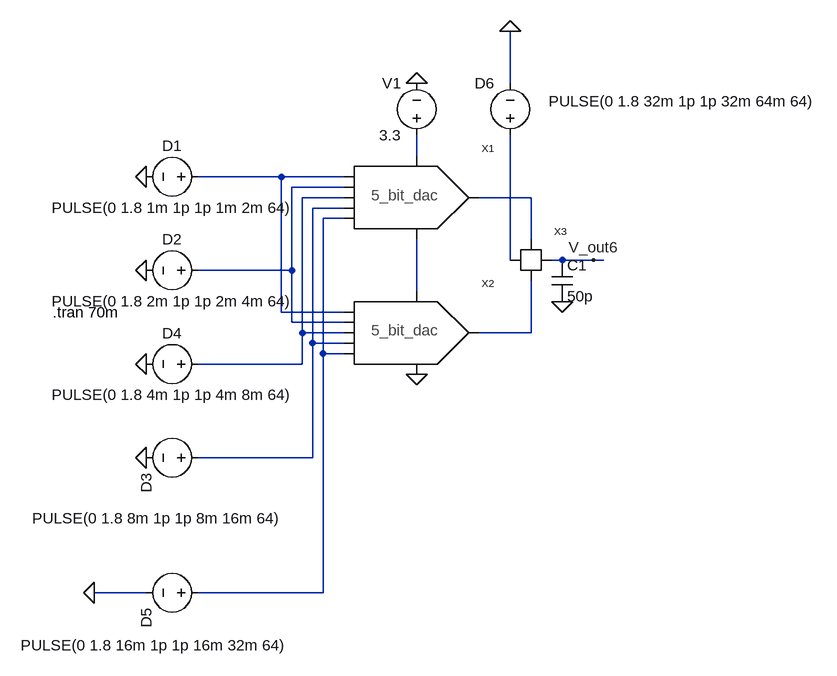
[diagram p0: schematic 6_bit_dac.asc]
6_bit_dac.asc, the LTspice schematic file:
Version 4
SHEET 1 880 836
WIRE 384 -48 384 -128
WIRE 240 64 240 32
WIRE 32 96 -96 96
WIRE 128 96 32 96
WIRE 128 112 48 112
WIRE 128 128 64 128
WIRE 416 128 336 128
WIRE 128 144 80 144
WIRE 128 160 96 160
WIRE 416 192 416 128
WIRE 384 224 384 32
WIRE 464 224 448 224
WIRE 512 224 464 224
WIRE 528 224 512 224
WIRE 48 240 48 112
WIRE 48 240 -96 240
WIRE 240 272 240 192
WIRE 32 304 32 96
WIRE 128 304 32 304
WIRE 48 320 48 240
WIRE 128 320 48 320
WIRE 64 336 64 128
WIRE 128 336 64 336
WIRE 416 336 416 256
WIRE 416 336 336 336
WIRE 80 352 80 144
WIRE 128 352 80 352
WIRE 96 368 96 160
WIRE 128 368 96 368
WIRE 64 384 64 336
WIRE 64 384 -96 384
WIRE 80 528 80 352
WIRE 80 528 -96 528
WIRE -176 736 -256 736
WIRE 96 736 96 368
WIRE 96 736 -96 736
FLAG -176 96 0
FLAG -176 240 0
FLAG -176 528 0
FLAG -176 384 0
FLAG -256 736 0
FLAG 240 -48 0
FLAG 240 400 0
FLAG 384 -128 0
FLAG 512 224 V_out6
FLAG 464 288 0
SYMBOL 5_bit_dac 192 128 R0
SYMATTR InstName X1
SYMBOL 5_bit_dac 192 336 R0
SYMATTR InstName X2
SYMBOL switch 416 224 R0
SYMATTR InstName X3
SYMBOL voltage -80 96 R90
WINDOW 0 -32 56 VBottom 2
WINDOW 3 32 56 VTop 2
WINDOW 123 0 0 Left 0
WINDOW 39 0 0 Left 0
SYMATTR InstName D1
SYMATTR Value PULSE(0 1.8 1m 1p 1p 1m 2m 64)
SYMBOL voltage -80 240 R90
WINDOW 0 -32 56 VBottom 2
WINDOW 3 32 56 VTop 2
WINDOW 123 0 0 Left 0
WINDOW 39 0 0 Left 0
SYMATTR InstName D2
SYMATTR Value PULSE(0 1.8 2m 1p 1p 2m 4m 64)
SYMBOL voltage -80 528 R90
WINDOW 0 24 96 Left 2
WINDOW 3 93 -113 VRight 2
WINDOW 123 0 0 Left 0
WINDOW 39 0 0 Left 0
SYMATTR InstName D3
SYMATTR Value PULSE(0 1.8 8m 1p 1p 8m 16m 64)
SYMBOL voltage -80 384 R90
WINDOW 0 -32 56 VBottom 2
WINDOW 3 32 56 VTop 2
WINDOW 123 0 0 Left 0
WINDOW 39 0 0 Left 0
SYMATTR InstName D4
SYMATTR Value PULSE(0 1.8 4m 1p 1p 4m 8m 64)
SYMBOL voltage -80 736 R90
WINDOW 0 24 96 Left 2
WINDOW 3 81 289 VLeft 2
WINDOW 123 0 0 Left 0
WINDOW 39 0 0 Left 0
SYMATTR InstName D5
SYMATTR Value PULSE(0 1.8 16m 1p 1p 16m 32m 64)
SYMBOL voltage 240 48 R180
WINDOW 0 24 96 Left 2
WINDOW 3 24 16 Left 2
WINDOW 123 0 0 Left 0
WINDOW 39 0 0 Left 0
SYMATTR InstName V1
SYMATTR Value 3.3
SYMBOL voltage 384 48 R180
WINDOW 0 24 96 Left 2
WINDOW 3 -471 68 Left 2
WINDOW 123 0 0 Left 0
WINDOW 39 0 0 Left 0
SYMATTR InstName D6
SYMATTR Value PULSE(0 1.8 32m 1p 1p 32m 64m 64)
SYMBOL cap 448 224 R0
SYMATTR InstName C1
SYMATTR Value 50p
TEXT -320 304 Left 2 !.tran 70m

The netlist it stands for:
* 6_bit_dac.asc
XX1 N002 N003 N004 N006 N007 N001 N009 N005 5_bit_dac  ; pins D0 D1 D2 D3 D4 R_in5 R_out5 V_out5
XX2 N002 N003 N004 N006 N007 N009 0 N010 5_bit_dac  ; pins D0 D1 D2 D3 D4 R_in5 R_out5 V_out5
XX3 N008 N005 N010 V_out6 switch  ; pins digital_input Vin_1 Vin_2 Vout
V§D1 N002 0 PULSE(0 1.8 1m 1p 1p 1m 2m 64)
V§D2 N003 0 PULSE(0 1.8 2m 1p 1p 2m 4m 64)
V§D3 N006 0 PULSE(0 1.8 8m 1p 1p 8m 16m 64)
V§D4 N004 0 PULSE(0 1.8 4m 1p 1p 4m 8m 64)
V§D5 N007 0 PULSE(0 1.8 16m 1p 1p 16m 32m 64)
V1 N001 0 3.3
V§D6 N008 0 PULSE(0 1.8 32m 1p 1p 32m 64m 64)
C1 V_out6 0 50p
.tran 70m
.backanno
.end